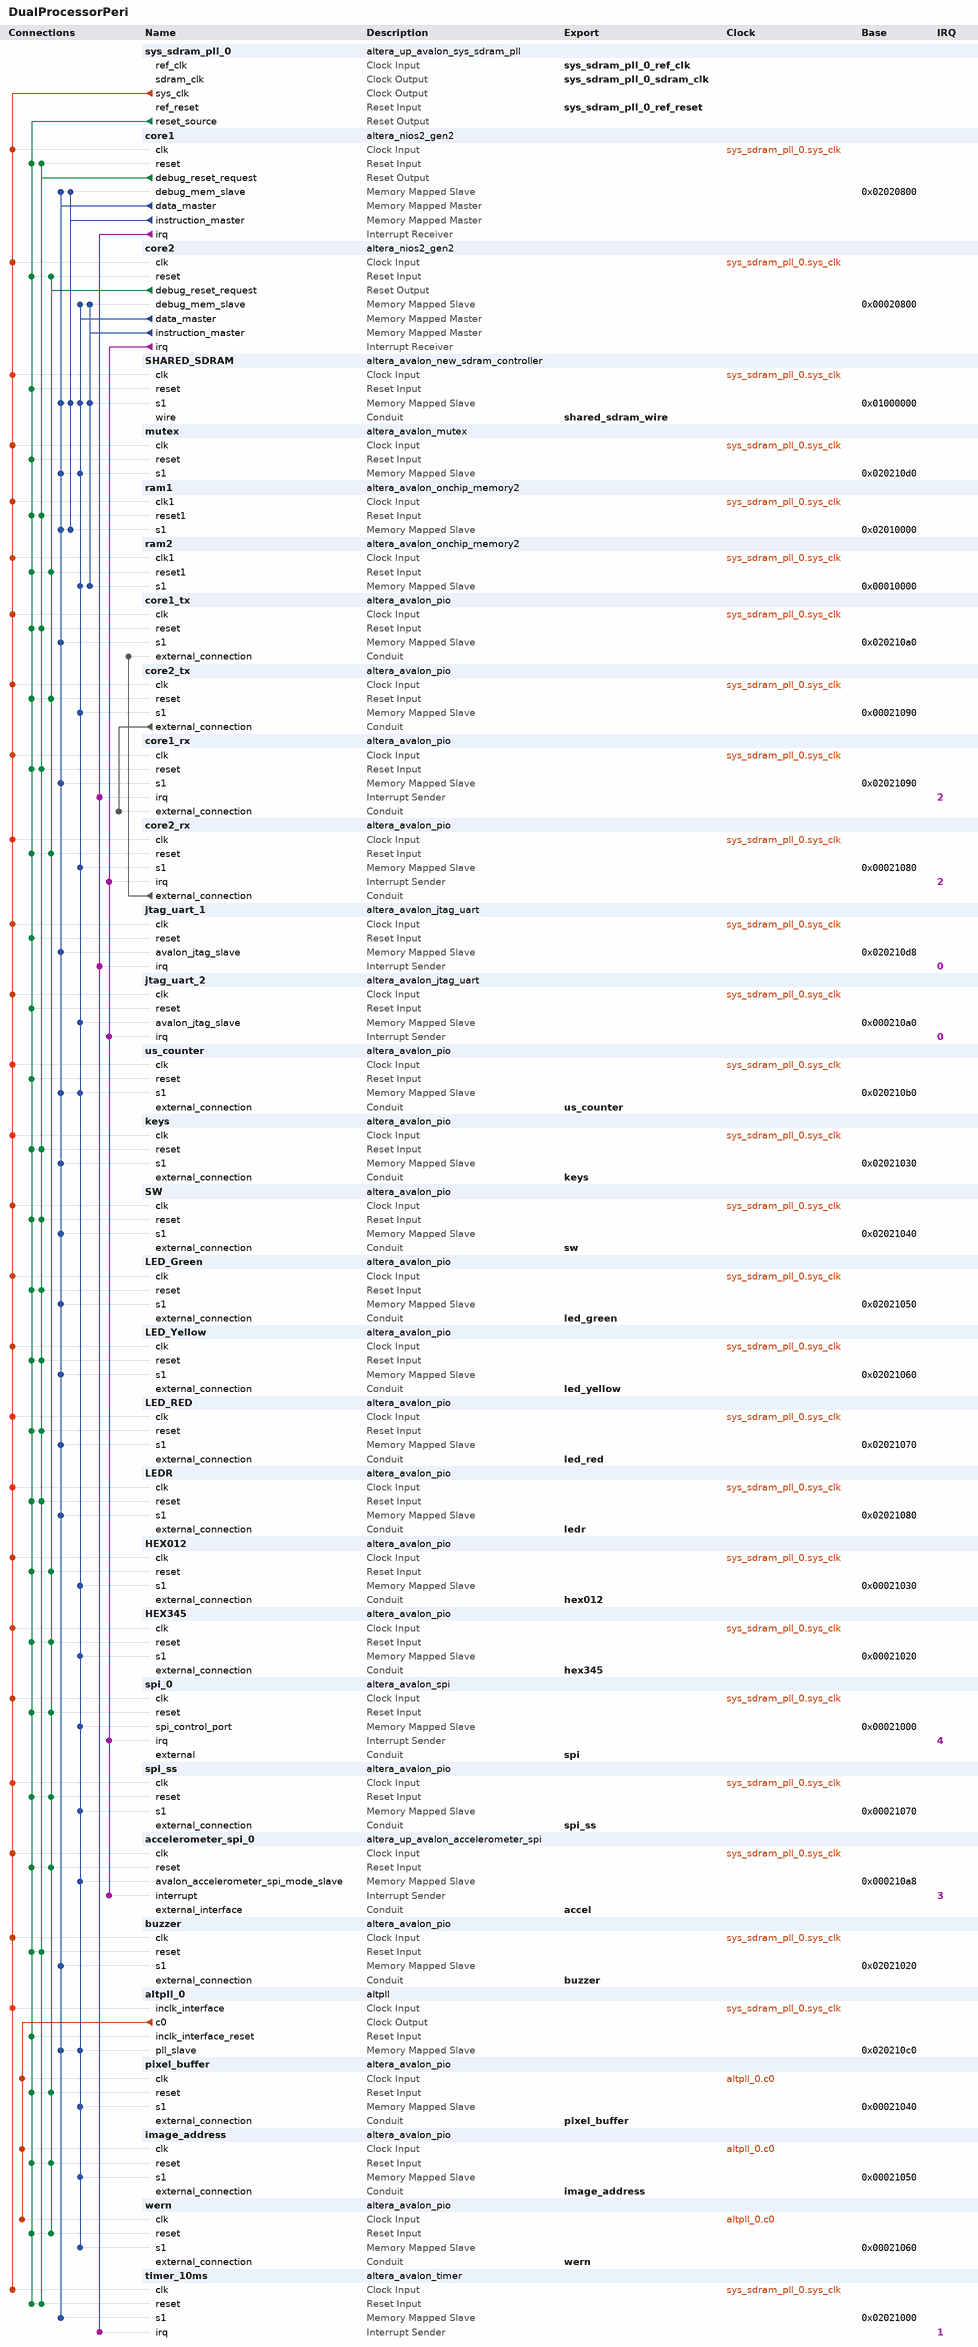
[diagram p0: system contents]
# Platform Designer (Qsys) system DualProcessorPeri, MAX 10 10M50DAF484C7G
# Parameters at their usual value, and those the tool derives, are not listed.
package require -exact qsys 18.1
create_system DualProcessorPeri
set_project_property DEVICE_FAMILY {MAX 10}
set_project_property DEVICE 10M50DAF484C7G

add_instance sys_sdram_pll_0 altera_up_avalon_sys_sdram_pll 18.0
set_instance_parameter_value sys_sdram_pll_0 CV_boards DE10-Standard
set_instance_parameter_value sys_sdram_pll_0 gui_outclk 50.0
set_instance_parameter_value sys_sdram_pll_0 gui_refclk 50.0

add_instance core1 altera_nios2_gen2 18.1
set_instance_parameter_value core1 cpuID 1
set_instance_parameter_value core1 dcache_size 2048
set_instance_parameter_value core1 exceptionSlave ram1.s1
set_instance_parameter_value core1 icache_size 4096
set_instance_parameter_value core1 impl Fast
set_instance_parameter_value core1 resetSlave ram1.s1

add_instance core2 altera_nios2_gen2 18.1
set_instance_parameter_value core2 cpuID 2
set_instance_parameter_value core2 dcache_size 2048
set_instance_parameter_value core2 exceptionSlave ram2.s1
set_instance_parameter_value core2 icache_size 4096
set_instance_parameter_value core2 impl Fast
set_instance_parameter_value core2 resetSlave ram2.s1

add_instance SHARED_SDRAM altera_avalon_new_sdram_controller 18.1
set_instance_parameter_value SHARED_SDRAM TAC 5.5
set_instance_parameter_value SHARED_SDRAM TRCD 20.0
set_instance_parameter_value SHARED_SDRAM TRP 20.0
set_instance_parameter_value SHARED_SDRAM casLatency 3
set_instance_parameter_value SHARED_SDRAM columnWidth 8
set_instance_parameter_value SHARED_SDRAM dataWidth 16
set_instance_parameter_value SHARED_SDRAM generateSimulationModel false
set_instance_parameter_value SHARED_SDRAM model single_Micron_MT48LC4M32B2_7_chip
set_instance_parameter_value SHARED_SDRAM numberOfBanks 4
set_instance_parameter_value SHARED_SDRAM numberOfChipSelects 1
set_instance_parameter_value SHARED_SDRAM powerUpDelay 100.0
set_instance_parameter_value SHARED_SDRAM refreshPeriod 15.625
set_instance_parameter_value SHARED_SDRAM rowWidth 13

add_instance mutex altera_avalon_mutex 18.1

add_instance ram1 altera_avalon_onchip_memory2 18.1
set_instance_parameter_value ram1 dataWidth 32
set_instance_parameter_value ram1 dualPort false
set_instance_parameter_value ram1 initMemContent true
set_instance_parameter_value ram1 initializationFileName onchip_mem.hex
set_instance_parameter_value ram1 memorySize 40960

add_instance ram2 altera_avalon_onchip_memory2 18.1
set_instance_parameter_value ram2 dataWidth 32
set_instance_parameter_value ram2 dualPort false
set_instance_parameter_value ram2 initMemContent true
set_instance_parameter_value ram2 initializationFileName onchip_mem.hex
set_instance_parameter_value ram2 memorySize 40960

add_instance core1_tx altera_avalon_pio 18.1
set_instance_parameter_value core1_tx direction Output
set_instance_parameter_value core1_tx width 1

add_instance core2_tx altera_avalon_pio 18.1
set_instance_parameter_value core2_tx direction Output
set_instance_parameter_value core2_tx width 1

add_instance core1_rx altera_avalon_pio 18.1
set_instance_parameter_value core1_rx direction Input
set_instance_parameter_value core1_rx generateIRQ true
set_instance_parameter_value core1_rx width 1

add_instance core2_rx altera_avalon_pio 18.1
set_instance_parameter_value core2_rx direction Input
set_instance_parameter_value core2_rx generateIRQ true
set_instance_parameter_value core2_rx width 1

add_instance jtag_uart_1 altera_avalon_jtag_uart 18.1
set_instance_parameter_value jtag_uart_1 simInteractiveOptions NO_INTERACTIVE_WINDOWS

add_instance jtag_uart_2 altera_avalon_jtag_uart 18.1
set_instance_parameter_value jtag_uart_2 simInteractiveOptions NO_INTERACTIVE_WINDOWS

add_instance us_counter altera_avalon_pio 18.1
set_instance_parameter_value us_counter direction Input
set_instance_parameter_value us_counter width 32

add_instance keys altera_avalon_pio 18.1
set_instance_parameter_value keys direction Input
set_instance_parameter_value keys width 2

add_instance SW altera_avalon_pio 18.1
set_instance_parameter_value SW direction Input
set_instance_parameter_value SW width 10

add_instance LED_Green altera_avalon_pio 18.1
set_instance_parameter_value LED_Green direction Output
set_instance_parameter_value LED_Green width 1

add_instance LED_Yellow altera_avalon_pio 18.1
set_instance_parameter_value LED_Yellow direction Output
set_instance_parameter_value LED_Yellow width 1

add_instance LED_RED altera_avalon_pio 18.1
set_instance_parameter_value LED_RED direction Output
set_instance_parameter_value LED_RED width 1

add_instance LEDR altera_avalon_pio 18.1
set_instance_parameter_value LEDR direction Output
set_instance_parameter_value LEDR width 8

add_instance HEX012 altera_avalon_pio 18.1
set_instance_parameter_value HEX012 direction Output
set_instance_parameter_value HEX012 width 24

add_instance HEX345 altera_avalon_pio 18.1
set_instance_parameter_value HEX345 direction Output
set_instance_parameter_value HEX345 width 24

add_instance spi_0 altera_avalon_spi 18.1
set_instance_parameter_value spi_0 clockPolarity 0
set_instance_parameter_value spi_0 dataWidth 8
set_instance_parameter_value spi_0 masterSPI true
set_instance_parameter_value spi_0 numberOfSlaves 1
set_instance_parameter_value spi_0 targetClockRate 128000

add_instance spi_ss altera_avalon_pio 18.1
set_instance_parameter_value spi_ss direction Output
set_instance_parameter_value spi_ss width 1

add_instance accelerometer_spi_0 altera_up_avalon_accelerometer_spi 18.0

add_instance buzzer altera_avalon_pio 18.1
set_instance_parameter_value buzzer direction Output
set_instance_parameter_value buzzer width 1

add_instance altpll_0 altpll 18.1
set_instance_parameter_value altpll_0 CLK0_DIVIDE_BY 4000
set_instance_parameter_value altpll_0 CLK0_MULTIPLY_BY 1007
set_instance_parameter_value altpll_0 INCLK0_INPUT_FREQUENCY 10000
set_instance_parameter_value altpll_0 PORT_ARESET PORT_UNUSED
set_instance_parameter_value altpll_0 PORT_LOCKED PORT_UNUSED
set_instance_parameter_value altpll_0 PORT_clk1 PORT_UNUSED
set_instance_parameter_value altpll_0 PORT_clk2 PORT_UNUSED
set_instance_parameter_value altpll_0 PORT_clk3 PORT_UNUSED

add_instance pixel_buffer altera_avalon_pio 18.1
set_instance_parameter_value pixel_buffer direction Output
set_instance_parameter_value pixel_buffer width 4

add_instance image_address altera_avalon_pio 18.1
set_instance_parameter_value image_address direction Output
set_instance_parameter_value image_address width 17

add_instance wern altera_avalon_pio 18.1
set_instance_parameter_value wern direction Output
set_instance_parameter_value wern width 1

add_instance timer_10ms altera_avalon_timer 18.1
set_instance_parameter_value timer_10ms period 10
set_instance_parameter_value timer_10ms periodUnits MSEC

# connections
add_connection altpll_0.c0 image_address.clk clock
add_connection altpll_0.c0 pixel_buffer.clk clock
add_connection altpll_0.c0 wern.clk clock
add_connection sys_sdram_pll_0.sys_clk accelerometer_spi_0.clk clock
add_connection sys_sdram_pll_0.sys_clk altpll_0.inclk_interface clock
add_connection sys_sdram_pll_0.sys_clk buzzer.clk clock
add_connection sys_sdram_pll_0.sys_clk core1.clk clock
add_connection sys_sdram_pll_0.sys_clk core1_rx.clk clock
add_connection sys_sdram_pll_0.sys_clk core1_tx.clk clock
add_connection sys_sdram_pll_0.sys_clk core2.clk clock
add_connection sys_sdram_pll_0.sys_clk core2_rx.clk clock
add_connection sys_sdram_pll_0.sys_clk core2_tx.clk clock
add_connection sys_sdram_pll_0.sys_clk HEX012.clk clock
add_connection sys_sdram_pll_0.sys_clk HEX345.clk clock
add_connection sys_sdram_pll_0.sys_clk jtag_uart_1.clk clock
add_connection sys_sdram_pll_0.sys_clk jtag_uart_2.clk clock
add_connection sys_sdram_pll_0.sys_clk keys.clk clock
add_connection sys_sdram_pll_0.sys_clk LED_Green.clk clock
add_connection sys_sdram_pll_0.sys_clk LED_RED.clk clock
add_connection sys_sdram_pll_0.sys_clk LED_Yellow.clk clock
add_connection sys_sdram_pll_0.sys_clk LEDR.clk clock
add_connection sys_sdram_pll_0.sys_clk mutex.clk clock
add_connection sys_sdram_pll_0.sys_clk ram1.clk1 clock
add_connection sys_sdram_pll_0.sys_clk ram2.clk1 clock
add_connection sys_sdram_pll_0.sys_clk SHARED_SDRAM.clk clock
add_connection sys_sdram_pll_0.sys_clk spi_0.clk clock
add_connection sys_sdram_pll_0.sys_clk spi_ss.clk clock
add_connection sys_sdram_pll_0.sys_clk SW.clk clock
add_connection sys_sdram_pll_0.sys_clk timer_10ms.clk clock
add_connection sys_sdram_pll_0.sys_clk us_counter.clk clock
add_connection core1.debug_reset_request buzzer.reset reset
add_connection core1.debug_reset_request core1.reset reset
add_connection core1.debug_reset_request core1_rx.reset reset
add_connection core1.debug_reset_request core1_tx.reset reset
add_connection core1.debug_reset_request keys.reset reset
add_connection core1.debug_reset_request LED_Green.reset reset
add_connection core1.debug_reset_request LED_RED.reset reset
add_connection core1.debug_reset_request LED_Yellow.reset reset
add_connection core1.debug_reset_request LEDR.reset reset
add_connection core1.debug_reset_request ram1.reset1 reset
add_connection core1.debug_reset_request SW.reset reset
add_connection core1.debug_reset_request timer_10ms.reset reset
add_connection core2.debug_reset_request accelerometer_spi_0.reset reset
add_connection core2.debug_reset_request core2.reset reset
add_connection core2.debug_reset_request core2_rx.reset reset
add_connection core2.debug_reset_request core2_tx.reset reset
add_connection core2.debug_reset_request HEX012.reset reset
add_connection core2.debug_reset_request HEX345.reset reset
add_connection core2.debug_reset_request image_address.reset reset
add_connection core2.debug_reset_request pixel_buffer.reset reset
add_connection core2.debug_reset_request ram2.reset1 reset
add_connection core2.debug_reset_request spi_0.reset reset
add_connection core2.debug_reset_request spi_ss.reset reset
add_connection core2.debug_reset_request wern.reset reset
add_connection sys_sdram_pll_0.reset_source accelerometer_spi_0.reset reset
add_connection sys_sdram_pll_0.reset_source altpll_0.inclk_interface_reset reset
add_connection sys_sdram_pll_0.reset_source buzzer.reset reset
add_connection sys_sdram_pll_0.reset_source core1.reset reset
add_connection sys_sdram_pll_0.reset_source core1_rx.reset reset
add_connection sys_sdram_pll_0.reset_source core1_tx.reset reset
add_connection sys_sdram_pll_0.reset_source core2.reset reset
add_connection sys_sdram_pll_0.reset_source core2_rx.reset reset
add_connection sys_sdram_pll_0.reset_source core2_tx.reset reset
add_connection sys_sdram_pll_0.reset_source HEX012.reset reset
add_connection sys_sdram_pll_0.reset_source HEX345.reset reset
add_connection sys_sdram_pll_0.reset_source image_address.reset reset
add_connection sys_sdram_pll_0.reset_source jtag_uart_1.reset reset
add_connection sys_sdram_pll_0.reset_source jtag_uart_2.reset reset
add_connection sys_sdram_pll_0.reset_source keys.reset reset
add_connection sys_sdram_pll_0.reset_source LED_Green.reset reset
add_connection sys_sdram_pll_0.reset_source LED_RED.reset reset
add_connection sys_sdram_pll_0.reset_source LED_Yellow.reset reset
add_connection sys_sdram_pll_0.reset_source LEDR.reset reset
add_connection sys_sdram_pll_0.reset_source mutex.reset reset
add_connection sys_sdram_pll_0.reset_source pixel_buffer.reset reset
add_connection sys_sdram_pll_0.reset_source ram1.reset1 reset
add_connection sys_sdram_pll_0.reset_source ram2.reset1 reset
add_connection sys_sdram_pll_0.reset_source SHARED_SDRAM.reset reset
add_connection sys_sdram_pll_0.reset_source spi_0.reset reset
add_connection sys_sdram_pll_0.reset_source spi_ss.reset reset
add_connection sys_sdram_pll_0.reset_source SW.reset reset
add_connection sys_sdram_pll_0.reset_source timer_10ms.reset reset
add_connection sys_sdram_pll_0.reset_source us_counter.reset reset
add_connection sys_sdram_pll_0.reset_source wern.reset reset
add_connection core1.data_master altpll_0.pll_slave avalon
set_connection_parameter_value core1.data_master/altpll_0.pll_slave baseAddress 0x020210c0
add_connection core1.data_master buzzer.s1 avalon
set_connection_parameter_value core1.data_master/buzzer.s1 baseAddress 0x02021020
add_connection core1.data_master core1.debug_mem_slave avalon
set_connection_parameter_value core1.data_master/core1.debug_mem_slave baseAddress 0x02020800
add_connection core1.data_master core1_rx.s1 avalon
set_connection_parameter_value core1.data_master/core1_rx.s1 baseAddress 0x02021090
add_connection core1.data_master core1_tx.s1 avalon
set_connection_parameter_value core1.data_master/core1_tx.s1 baseAddress 0x020210a0
add_connection core1.data_master jtag_uart_1.avalon_jtag_slave avalon
set_connection_parameter_value core1.data_master/jtag_uart_1.avalon_jtag_slave baseAddress 0x020210d8
add_connection core1.data_master keys.s1 avalon
set_connection_parameter_value core1.data_master/keys.s1 baseAddress 0x02021030
add_connection core1.data_master LED_Green.s1 avalon
set_connection_parameter_value core1.data_master/LED_Green.s1 baseAddress 0x02021050
add_connection core1.data_master LED_RED.s1 avalon
set_connection_parameter_value core1.data_master/LED_RED.s1 baseAddress 0x02021070
add_connection core1.data_master LED_Yellow.s1 avalon
set_connection_parameter_value core1.data_master/LED_Yellow.s1 baseAddress 0x02021060
add_connection core1.data_master LEDR.s1 avalon
set_connection_parameter_value core1.data_master/LEDR.s1 baseAddress 0x02021080
add_connection core1.data_master mutex.s1 avalon
set_connection_parameter_value core1.data_master/mutex.s1 baseAddress 0x020210d0
add_connection core1.data_master ram1.s1 avalon
set_connection_parameter_value core1.data_master/ram1.s1 baseAddress 0x02010000
add_connection core1.data_master SHARED_SDRAM.s1 avalon
set_connection_parameter_value core1.data_master/SHARED_SDRAM.s1 baseAddress 0x01000000
add_connection core1.data_master SW.s1 avalon
set_connection_parameter_value core1.data_master/SW.s1 baseAddress 0x02021040
add_connection core1.data_master timer_10ms.s1 avalon
set_connection_parameter_value core1.data_master/timer_10ms.s1 baseAddress 0x02021000
add_connection core1.data_master us_counter.s1 avalon
set_connection_parameter_value core1.data_master/us_counter.s1 baseAddress 0x020210b0
add_connection core1.instruction_master core1.debug_mem_slave avalon
set_connection_parameter_value core1.instruction_master/core1.debug_mem_slave baseAddress 0x02020800
add_connection core1.instruction_master ram1.s1 avalon
set_connection_parameter_value core1.instruction_master/ram1.s1 baseAddress 0x02010000
add_connection core1.instruction_master SHARED_SDRAM.s1 avalon
set_connection_parameter_value core1.instruction_master/SHARED_SDRAM.s1 baseAddress 0x01000000
add_connection core2.data_master accelerometer_spi_0.avalon_accelerometer_spi_mode_slave avalon
set_connection_parameter_value core2.data_master/accelerometer_spi_0.avalon_accelerometer_spi_mode_slave baseAddress 0x000210a8
add_connection core2.data_master altpll_0.pll_slave avalon
set_connection_parameter_value core2.data_master/altpll_0.pll_slave baseAddress 0x020210c0
add_connection core2.data_master core2.debug_mem_slave avalon
set_connection_parameter_value core2.data_master/core2.debug_mem_slave baseAddress 0x00020800
add_connection core2.data_master core2_rx.s1 avalon
set_connection_parameter_value core2.data_master/core2_rx.s1 baseAddress 0x00021080
add_connection core2.data_master core2_tx.s1 avalon
set_connection_parameter_value core2.data_master/core2_tx.s1 baseAddress 0x00021090
add_connection core2.data_master HEX012.s1 avalon
set_connection_parameter_value core2.data_master/HEX012.s1 baseAddress 0x00021030
add_connection core2.data_master HEX345.s1 avalon
set_connection_parameter_value core2.data_master/HEX345.s1 baseAddress 0x00021020
add_connection core2.data_master image_address.s1 avalon
set_connection_parameter_value core2.data_master/image_address.s1 baseAddress 0x00021050
add_connection core2.data_master jtag_uart_2.avalon_jtag_slave avalon
set_connection_parameter_value core2.data_master/jtag_uart_2.avalon_jtag_slave baseAddress 0x000210a0
add_connection core2.data_master mutex.s1 avalon
set_connection_parameter_value core2.data_master/mutex.s1 baseAddress 0x020210d0
add_connection core2.data_master pixel_buffer.s1 avalon
set_connection_parameter_value core2.data_master/pixel_buffer.s1 baseAddress 0x00021040
add_connection core2.data_master ram2.s1 avalon
set_connection_parameter_value core2.data_master/ram2.s1 baseAddress 0x00010000
add_connection core2.data_master SHARED_SDRAM.s1 avalon
set_connection_parameter_value core2.data_master/SHARED_SDRAM.s1 baseAddress 0x01000000
add_connection core2.data_master spi_0.spi_control_port avalon
set_connection_parameter_value core2.data_master/spi_0.spi_control_port baseAddress 0x00021000
add_connection core2.data_master spi_ss.s1 avalon
set_connection_parameter_value core2.data_master/spi_ss.s1 baseAddress 0x00021070
add_connection core2.data_master us_counter.s1 avalon
set_connection_parameter_value core2.data_master/us_counter.s1 baseAddress 0x020210b0
add_connection core2.data_master wern.s1 avalon
set_connection_parameter_value core2.data_master/wern.s1 baseAddress 0x00021060
add_connection core2.instruction_master core2.debug_mem_slave avalon
set_connection_parameter_value core2.instruction_master/core2.debug_mem_slave baseAddress 0x00020800
add_connection core2.instruction_master ram2.s1 avalon
set_connection_parameter_value core2.instruction_master/ram2.s1 baseAddress 0x00010000
add_connection core2.instruction_master SHARED_SDRAM.s1 avalon
set_connection_parameter_value core2.instruction_master/SHARED_SDRAM.s1 baseAddress 0x01000000
add_connection core2_rx.external_connection core1_tx.external_connection conduit
add_connection core2_tx.external_connection core1_rx.external_connection conduit
add_connection core1.irq core1_rx.irq interrupt
set_connection_parameter_value core1.irq/core1_rx.irq irqNumber 2
add_connection core1.irq jtag_uart_1.irq interrupt
set_connection_parameter_value core1.irq/jtag_uart_1.irq irqNumber 0
add_connection core1.irq timer_10ms.irq interrupt
set_connection_parameter_value core1.irq/timer_10ms.irq irqNumber 1
add_connection core2.irq accelerometer_spi_0.interrupt interrupt
set_connection_parameter_value core2.irq/accelerometer_spi_0.interrupt irqNumber 3
add_connection core2.irq core2_rx.irq interrupt
set_connection_parameter_value core2.irq/core2_rx.irq irqNumber 2
add_connection core2.irq jtag_uart_2.irq interrupt
set_connection_parameter_value core2.irq/jtag_uart_2.irq irqNumber 0
add_connection core2.irq spi_0.irq interrupt
set_connection_parameter_value core2.irq/spi_0.irq irqNumber 4

# exported interfaces
add_interface accel conduit end
set_interface_property accel EXPORT_OF accelerometer_spi_0.external_interface
add_interface buzzer conduit end
set_interface_property buzzer EXPORT_OF buzzer.external_connection
add_interface hex012 conduit end
set_interface_property hex012 EXPORT_OF HEX012.external_connection
add_interface hex345 conduit end
set_interface_property hex345 EXPORT_OF HEX345.external_connection
add_interface image_address conduit end
set_interface_property image_address EXPORT_OF image_address.external_connection
add_interface keys conduit end
set_interface_property keys EXPORT_OF keys.external_connection
add_interface led_green conduit end
set_interface_property led_green EXPORT_OF LED_Green.external_connection
add_interface led_red conduit end
set_interface_property led_red EXPORT_OF LED_RED.external_connection
add_interface led_yellow conduit end
set_interface_property led_yellow EXPORT_OF LED_Yellow.external_connection
add_interface ledr conduit end
set_interface_property ledr EXPORT_OF LEDR.external_connection
add_interface pixel_buffer conduit end
set_interface_property pixel_buffer EXPORT_OF pixel_buffer.external_connection
add_interface shared_sdram_wire conduit end
set_interface_property shared_sdram_wire EXPORT_OF SHARED_SDRAM.wire
add_interface spi conduit end
set_interface_property spi EXPORT_OF spi_0.external
add_interface spi_ss conduit end
set_interface_property spi_ss EXPORT_OF spi_ss.external_connection
add_interface sw conduit end
set_interface_property sw EXPORT_OF SW.external_connection
add_interface sys_sdram_pll_0_ref_clk clock sink
set_interface_property sys_sdram_pll_0_ref_clk EXPORT_OF sys_sdram_pll_0.ref_clk
add_interface sys_sdram_pll_0_ref_reset reset sink
set_interface_property sys_sdram_pll_0_ref_reset EXPORT_OF sys_sdram_pll_0.ref_reset
add_interface sys_sdram_pll_0_sdram_clk clock source
set_interface_property sys_sdram_pll_0_sdram_clk EXPORT_OF sys_sdram_pll_0.sdram_clk
add_interface us_counter conduit end
set_interface_property us_counter EXPORT_OF us_counter.external_connection
add_interface wern conduit end
set_interface_property wern EXPORT_OF wern.external_connection

set_interconnect_requirement {$system} qsys_mm.clockCrossingAdapter HANDSHAKE
set_interconnect_requirement {$system} qsys_mm.enableEccProtection FALSE
set_interconnect_requirement {$system} qsys_mm.insertDefaultSlave FALSE
set_interconnect_requirement {$system} qsys_mm.maxAdditionalLatency 1

save_system DualProcessorPeri.qsys
